# Altium schematic sheet 25_SATA-SATA PM0.SchDoc
size 594 x 420 mm
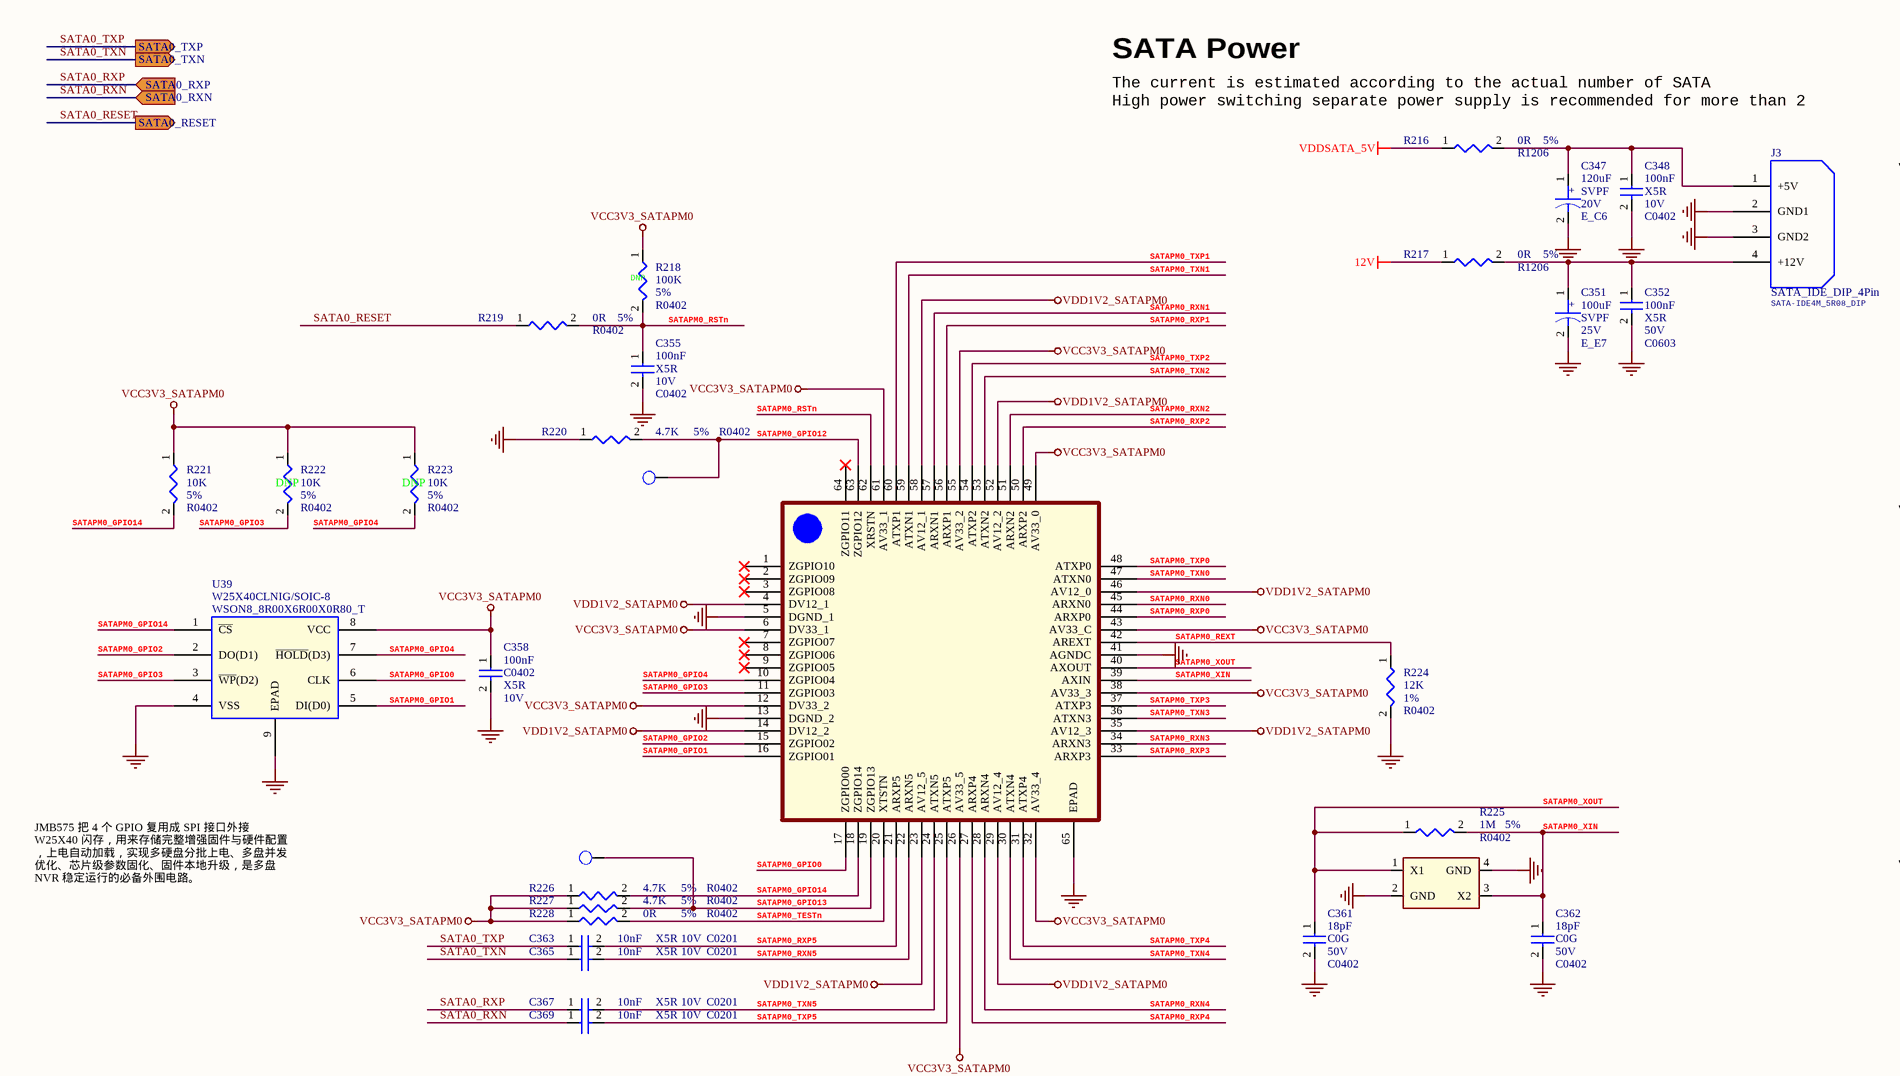
[diagram p0: 25_SATA-SATA PM0.SchDoc, top left]
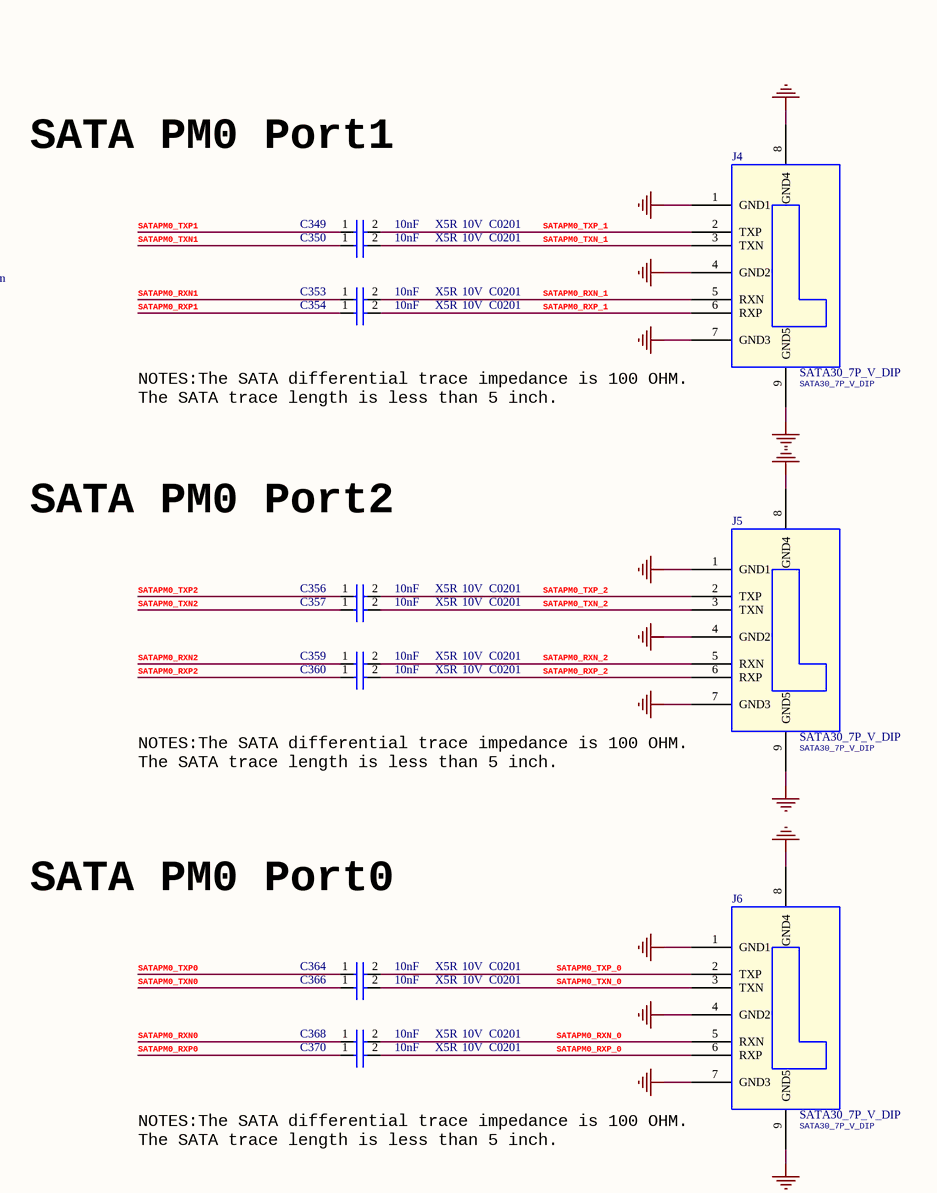
[diagram p1: 25_SATA-SATA PM0.SchDoc, top right]
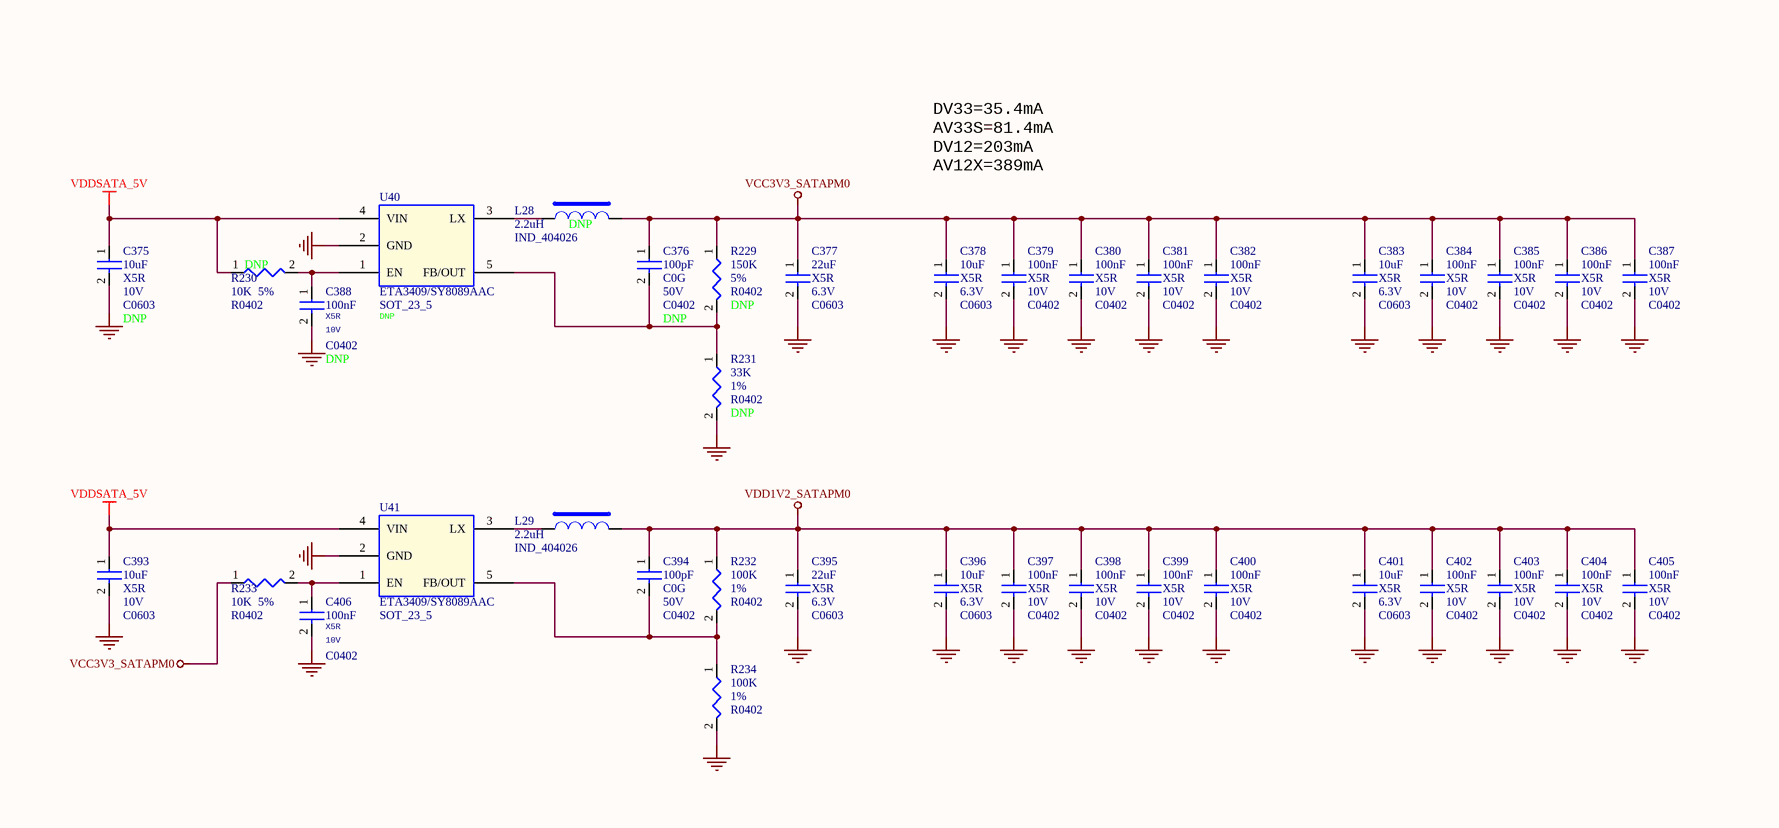
[diagram p2: 25_SATA-SATA PM0.SchDoc, bottom left]
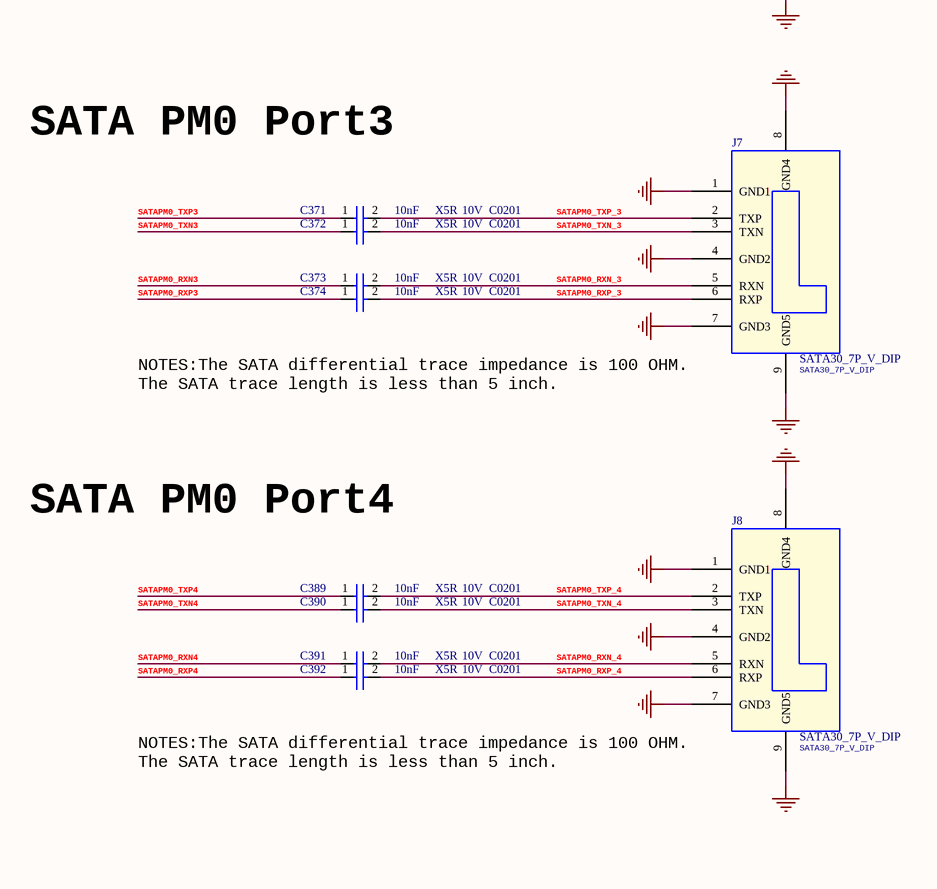
[diagram p3: 25_SATA-SATA PM0.SchDoc, bottom right]

## Parts
C347  120uF  Voltage: 20V  Dielectric: SVPF  [E_C6]
C348  100nF  Voltage: 10V  Dielectric: X5R  [C0402]
C349  10nF  Voltage: 10V  Dielectric: X5R  [C0201]
C350  10nF  Voltage: 10V  Dielectric: X5R  [C0201]
C351  100uF  Voltage: 25V  Dielectric: SVPF  [E_E7]
C352  100nF  Voltage: 50V  Dielectric: X5R  [C0603]
C353  10nF  Voltage: 10V  Dielectric: X5R  [C0201]
C354  10nF  Voltage: 10V  Dielectric: X5R  [C0201]
C355  100nF  Voltage: 10V  Dielectric: X5R  [C0402]
C356  10nF  Voltage: 10V  Dielectric: X5R  [C0201]
C357  10nF  Voltage: 10V  Dielectric: X5R  [C0201]
C358  100nF  Voltage: 10V  Dielectric: X5R  [C0402]
C359  10nF  Voltage: 10V  Dielectric: X5R  [C0201]
C360  10nF  Voltage: 10V  Dielectric: X5R  [C0201]
C361  18pF  Voltage: 50V  Dielectric: C0G  [C0402]
C362  18pF  Voltage: 50V  Dielectric: C0G  [C0402]
C363  10nF  Voltage: 10V  Dielectric: X5R  [C0201]
C364  10nF  Voltage: 10V  Dielectric: X5R  [C0201]
C365  10nF  Voltage: 10V  Dielectric: X5R  [C0201]
C366  10nF  Voltage: 10V  Dielectric: X5R  [C0201]
C367  10nF  Voltage: 10V  Dielectric: X5R  [C0201]
C368  10nF  Voltage: 10V  Dielectric: X5R  [C0201]
C369  10nF  Voltage: 10V  Dielectric: X5R  [C0201]
C370  10nF  Voltage: 10V  Dielectric: X5R  [C0201]
C371  10nF  Voltage: 10V  Dielectric: X5R  [C0201]
C372  10nF  Voltage: 10V  Dielectric: X5R  [C0201]
C373  10nF  Voltage: 10V  Dielectric: X5R  [C0201]
C374  10nF  Voltage: 10V  Dielectric: X5R  [C0201]
C375  10uF  Voltage: 10V  Dielectric: X5R  option: DNP  [C0603]
C376  100pF  Voltage: 50V  Dielectric: C0G  option: DNP  [C0402]
C377  22uF  Voltage: 6.3V  Dielectric: X5R  [C0603]
C378  10uF  Voltage: 6.3V  Dielectric: X5R  [C0603]
C379  100nF  Voltage: 10V  Dielectric: X5R  [C0402]
C380  100nF  Voltage: 10V  Dielectric: X5R  [C0402]
C381  100nF  Voltage: 10V  Dielectric: X5R  [C0402]
C382  100nF  Voltage: 10V  Dielectric: X5R  [C0402]
C383  10uF  Voltage: 6.3V  Dielectric: X5R  [C0603]
C384  100nF  Voltage: 10V  Dielectric: X5R  [C0402]
C385  100nF  Voltage: 10V  Dielectric: X5R  [C0402]
C386  100nF  Voltage: 10V  Dielectric: X5R  [C0402]
C387  100nF  Voltage: 10V  Dielectric: X5R  [C0402]
C388  100nF  Voltage: 10V  Dielectric: X5R  option: DNP  [C0402]
C389  10nF  Voltage: 10V  Dielectric: X5R  [C0201]
C390  10nF  Voltage: 10V  Dielectric: X5R  [C0201]
C391  10nF  Voltage: 10V  Dielectric: X5R  [C0201]
C392  10nF  Voltage: 10V  Dielectric: X5R  [C0201]
C393  10uF  Voltage: 10V  Dielectric: X5R  [C0603]
C394  100pF  Voltage: 50V  Dielectric: C0G  [C0402]
C395  22uF  Voltage: 6.3V  Dielectric: X5R  [C0603]
C396  10uF  Voltage: 6.3V  Dielectric: X5R  [C0603]
C397  100nF  Voltage: 10V  Dielectric: X5R  [C0402]
C398  100nF  Voltage: 10V  Dielectric: X5R  [C0402]
C399  100nF  Voltage: 10V  Dielectric: X5R  [C0402]
C400  100nF  Voltage: 10V  Dielectric: X5R  [C0402]
C401  10uF  Voltage: 6.3V  Dielectric: X5R  [C0603]
C402  100nF  Voltage: 10V  Dielectric: X5R  [C0402]
C403  100nF  Voltage: 10V  Dielectric: X5R  [C0402]
C404  100nF  Voltage: 10V  Dielectric: X5R  [C0402]
C405  100nF  Voltage: 10V  Dielectric: X5R  [C0402]
C406  100nF  Voltage: 10V  Dielectric: X5R  [C0402]
J3  SATA_IDE_DIP_4Pin  [SATA-IDE4M_5R08_DIP]
J4  SATA30_7P_V_DIP  [SATA30_7P_V_DIP]
J5  SATA30_7P_V_DIP  [SATA30_7P_V_DIP]
J6  SATA30_7P_V_DIP  [SATA30_7P_V_DIP]
J7  SATA30_7P_V_DIP  [SATA30_7P_V_DIP]
J8  SATA30_7P_V_DIP  [SATA30_7P_V_DIP]
L28  2.2uH  option: DNP  [IND_404026]
L29  2.2uH  [IND_404026]
R216  0R  PCB Footprint: R1206  Tolerance: 5%  [R0402]
R217  0R  PCB Footprint: R1206  Tolerance: 5%  [R0402]
R218  100K  Tolerance: 5%  Option: DNP  [R0402]
R219  0R  Tolerance: 5%  [R0402]
R220  4.7K  Tolerance: 5%  [R0402]
R221  10K  Tolerance: 5%  [R0402]
R222  10K  Tolerance: 5%  Option: DNP  [R0402]
R223  10K  Tolerance: 5%  Option: DNP  [R0402]
R224  12K  Tolerance: 1%  [R0402]
R225  1M  Tolerance: 5%  [R0402]
R226  4.7K  Tolerance: 5%  [R0402]
R227  4.7K  Tolerance: 5%  [R0402]
R228  0R  Tolerance: 5%  [R0402]
R229  150K  Tolerance: 5%  option: DNP  [R0402]
R230  10K  Tolerance: 5%  option: DNP  [R0402]
R231  33K  Tolerance: 1%  option: DNP  [R0402]
R232  100K  Tolerance: 1%  [R0402]
R233  10K  Tolerance: 5%  [R0402]
R234  100K  Tolerance: 1%  [R0402]
TP3  TP  [TP_0R70]  (value not drawn)
TP4  TP  [TP_0R70]  (value not drawn)
U38  JMB575  [QFN64_9R00X9R00X0R90_T]  (value not drawn)
U39  W25X40CLNIG/SOIC-8  [WSON8_8R00X6R00X0R80_T]
U40  ETA3409/SY8089AAC  option: DNP  [SOT_23_5]
U41  ETA3409/SY8089AAC  [SOT_23_5]
Y4  CRYSTAL_4P  [CRY4_3R20X2R50X0R80]  (value not drawn)

## Ports
SATA0_RESET (out), SATA0_RXN (in), SATA0_RXP (in), SATA0_TXN (out), SATA0_TXP (out)

## Nets
12V: R217.1
GND: C347.2 C348.2 C351.2 C352.2 C355.2 C358.2 C361.2 C362.2 C375.2 C377.2 C378.2 C379.2 C380.2 C381.2 C382.2 C383.2 C384.2 C385.2 C386.2 C387.2 C388.2 C393.2 C395.2 C396.2 C397.2 C398.2 C399.2 C400.2 C401.2 C402.2 C403.2 C404.2 C405.2 C406.2 J3.2(GND1) J3.3(GND2) J4.1(GND1) J4.4(GND2) J4.7(GND3) J4.8(GND4) J4.9(GND5) J5.1(GND1) J5.4(GND2) J5.7(GND3) J5.8(GND4) J5.9(GND5) J6.1(GND1) J6.4(GND2) J6.7(GND3) J6.8(GND4) J6.9(GND5) J7.1(GND1) J7.4(GND2) J7.7(GND3) J7.8(GND4) J7.9(GND5) J8.1(GND1) J8.4(GND2) J8.7(GND3) J8.8(GND4) J8.9(GND5) R220.1 R224.2 R231.2 R234.2 U38.5(DGND_1) U38.13(DGND_2) U38.41(AGNDC) U38.65(EPAD) U39.4(VSS) U39.9(EPAD) U40.2(GND) U41.2(GND) Y4.2(GND) Y4.4(GND)
VCC3V3_SATAPM0: C358.1 C376.1 C377.1 C378.1 C379.1 C380.1 C381.1 C382.1 C383.1 C384.1 C385.1 C386.1 C387.1 L28.2 R218.1 R221.1 R222.1 R223.1 R226.1 R227.1 R228.1 R229.1 R233.1 U38.6(DV33_1) U38.12(DV33_2) U38.26(AV33_5) U38.32(AV33_4) U38.38(AV33_3) U38.43(AV33_C) U38.49(AV33_0) U38.55(AV33_2) U38.61(AV33_1) U39.8(VCC)
VDD1V2_SATAPM0: C394.1 C395.1 C396.1 C397.1 C398.1 C399.1 C400.1 C401.1 C402.1 C403.1 C404.1 C405.1 L29.2 R232.1 U38.4(DV12_1) U38.14(DV12_2) U38.23(AV12_5) U38.29(AV12_4) U38.35(AV12_3) U38.46(AV12_0) U38.52(AV12_2) U38.58(AV12_1)
VDDSATA_5V: C375.1 C393.1 R216.1 R230.1 U40.4(VIN) U41.4(VIN)
SATA0_RESET: R219.1 ; port SATA0_RESET
SATA0_RXN: C369.1 ; port SATA0_RXN
SATA0_RXP: C367.1 ; port SATA0_RXP
SATA0_TXN: C365.1 ; port SATA0_TXN
SATA0_TXP: C363.1 ; port SATA0_TXP
SATAPM0_GPIO0: U38.17(ZGPIO00) U39.6(CLK)
SATAPM0_GPIO1: U38.16(ZGPIO01) U39.5(DI(D0))
SATAPM0_GPIO2: U38.15(ZGPIO02) U39.2(DO(D1))
SATAPM0_GPIO3: R222.2 U38.11(ZGPIO03) U39.3(~{WP}(D2))
SATAPM0_GPIO4: R223.2 U38.10(ZGPIO04) U39.7(~{HOLD}(D3))
SATAPM0_GPIO12: R220.2 TP3.1 U38.63(ZGPIO12)
SATAPM0_GPIO13: R227.2 TP4.1 U38.19(ZGPIO13)
SATAPM0_GPIO14: R221.2 R226.2 U38.18(ZGPIO14) U39.1(~{CS})
SATAPM0_REXT: R224.1 U38.42(AREXT)
SATAPM0_RSTn: C355.1 R218.2 R219.2 U38.62(XRSTN)
SATAPM0_RXN0: C368.1 U38.45(ARXN0)
SATAPM0_RXN1: C353.1 U38.57(ARXN1)
SATAPM0_RXN2: C359.1 U38.51(ARXN2)
SATAPM0_RXN3: C373.1 U38.34(ARXN3)
SATAPM0_RXN4: C391.1 U38.28(ARXN4)
SATAPM0_RXN5: C365.2 U38.22(ARXN5)
SATAPM0_RXN_0: C368.2 J6.5(RXN)
SATAPM0_RXN_1: C353.2 J4.5(RXN)
SATAPM0_RXN_2: C359.2 J5.5(RXN)
SATAPM0_RXN_3: C373.2 J7.5(RXN)
SATAPM0_RXN_4: C391.2 J8.5(RXN)
SATAPM0_RXP0: C370.1 U38.44(ARXP0)
SATAPM0_RXP1: C354.1 U38.56(ARXP1)
SATAPM0_RXP2: C360.1 U38.50(ARXP2)
SATAPM0_RXP3: C374.1 U38.33(ARXP3)
SATAPM0_RXP4: C392.1 U38.27(ARXP4)
SATAPM0_RXP5: C363.2 U38.21(ARXP5)
SATAPM0_RXP_0: C370.2 J6.6(RXP)
SATAPM0_RXP_1: C354.2 J4.6(RXP)
SATAPM0_RXP_2: C360.2 J5.6(RXP)
SATAPM0_RXP_3: C374.2 J7.6(RXP)
SATAPM0_RXP_4: C392.2 J8.6(RXP)
SATAPM0_TESTn: R228.2 U38.20(XTSTN)
SATAPM0_TXN0: C366.1 U38.47(ATXN0)
SATAPM0_TXN1: C350.1 U38.59(ATXN1)
SATAPM0_TXN2: C357.1 U38.53(ATXN2)
SATAPM0_TXN3: C372.1 U38.36(ATXN3)
SATAPM0_TXN4: C390.1 U38.30(ATXN4)
SATAPM0_TXN5: C367.2 U38.24(ATXN5)
SATAPM0_TXN_0: C366.2 J6.3(TXN)
SATAPM0_TXN_1: C350.2 J4.3(TXN)
SATAPM0_TXN_2: C357.2 J5.3(TXN)
SATAPM0_TXN_3: C372.2 J7.3(TXN)
SATAPM0_TXN_4: C390.2 J8.3(TXN)
SATAPM0_TXP0: C364.1 U38.48(ATXP0)
SATAPM0_TXP1: C349.1 U38.60(ATXP1)
SATAPM0_TXP2: C356.1 U38.54(ATXP2)
SATAPM0_TXP3: C371.1 U38.37(ATXP3)
SATAPM0_TXP4: C389.1 U38.31(ATXP4)
SATAPM0_TXP5: C369.2 U38.25(ATXP5)
SATAPM0_TXP_0: C364.2 J6.2(TXP)
SATAPM0_TXP_1: C349.2 J4.2(TXP)
SATAPM0_TXP_2: C356.2 J5.2(TXP)
SATAPM0_TXP_3: C371.2 J7.2(TXP)
SATAPM0_TXP_4: C389.2 J8.2(TXP)
SATAPM0_XIN: C362.1 R225.2 U38.39(AXIN) Y4.3(X2)
SATAPM0_XOUT: C361.1 R225.1 U38.40(AXOUT) Y4.1(X1)
NetC347_1: C347.1 C348.1 J3.1(+5V) R216.2
NetC351_1: C351.1 C352.1 J3.4(+12V) R217.2
NetC376_2: C376.2 R229.2 R231.1 U40.5(FB/OUT)
NetC388_1: C388.1 R230.2 U40.1(EN)
NetC394_2: C394.2 R232.2 R234.1 U41.5(FB/OUT)
NetC406_1: C406.1 R233.2 U41.1(EN)
NetL28_1: L28.1 U40.3(LX)
NetL29_1: L29.1 U41.3(LX)

Not connected (* = marked no-connect by the designer): U38 1(ZGPIO10)* 2(ZGPIO09)* 3(ZGPIO08)* 7(ZGPIO07)* 8(ZGPIO06)* 9(ZGPIO05)* 64(ZGPIO11)*

## Notes on the sheet
- SATA Power
- (near R216) The current is estimated according to the actual number of SATA
  High power switching separate power supply is recommended for more than 2
- SATA PM0 Port1
- (near J4) NOTES:The SATA differential trace impedance is 100 OHM.
  The SATA trace length is less than 5 inch.
- SATA PM0 Port2
- (near J5) NOTES:The SATA differential trace impedance is 100 OHM.
  The SATA trace length is less than 5 inch.
- SATA PM0 Port0
- JMB575 把 4 个 GPIO 复用成 SPI 接口外接 W25X40 闪存，用来存储完整增强固件与硬件配置，上电自动加载，实现多硬盘分批上电、多盘并发优化、芯片级参数固化、固件本地升级，是多盘 NVR 稳定运行的必备外围电路。
- (near J6) NOTES:The SATA differential trace impedance is 100 OHM.
  The SATA trace length is less than 5 inch.
- SATA PM0 Port3
- DV33=35.4mA
  AV33S=81.4mA
  DV12=203mA
  AV12X=389mA
- (near J7) NOTES:The SATA differential trace impedance is 100 OHM.
  The SATA trace length is less than 5 inch.
- SATA PM0 Port4
- (near J8) NOTES:The SATA differential trace impedance is 100 OHM.
  The SATA trace length is less than 5 inch.
- (in symbol CAP) +

## Library data of the parts
C347 = CAP: 120uF,20V,25mR,SVPF; Manufacturer PN: 25SVPF100M; Manufacturer: Panasonic; Tolerance: 20%; Priority: A; PCB Footprint: E_C6; Created by: JJJ; Part Type: 贴片固态铝电解; RK PN: 25SVPF100M
C348 = CAP NP: cap,100.00nF,+/-10%,10V,X5R,C0402; Manufacturer: TDK; Number: 37; RK PN: C1005X5R1A104K050BA; Priority: A; Tolerance: 10%; C_Voltage: 6.3V; PCB Footprint: C0402; Part Type: C0402; Manufacturer PN: C1005X5R1A104K050BA; Created by: JJJ
C349 C350 C353 C354 C356 C357 C359 C360 C364 C366 C368 C370-C374 C389-C392 = CAP NP: cap,10.00nF,+/-10%,10V,X5R,C0201; Manufacturer PN: C0603X5R1A103K030BA; Manufacturer: TDK; Tolerance: 10%; Priority: A; PCB Footprint: C0201; Created by: JJJ; Part Type: C0201; RK PN: C0603X5R1A103K030BA
C351 = CAP: 100uF,25V,24mR,SVPF; Manufacturer PN: 25SVPF100M; Manufacturer: Panasonic; Tolerance: 20%; Priority: A; PCB Footprint: E_E7; Created by: JJJ; Part Type: 贴片固态铝电解; RK PN: 25SVPF100M
C352 = CAP NP: cap,100.00nF,+/-10%,50V,X5R,C0603; Manufacturer PN: C1608X5R1H104K080AA; Manufacturer: TDK; Tolerance: 10%; Priority: A; PCB Footprint: C0603; Created by: JJJ; Part Type: C0603; RK PN: C1608X5R1H104K080AA
C355 C358 = CAP NP: cap,100.00nF,+/-10%,10V,X5R,C0402; Manufacturer: TDK; RK PN: C1005X5R1A104K050BA; Priority: A; Tolerance: 10%; PCB Footprint: C0402; Part Type: C0402; Manufacturer PN: C1005X5R1A104K050BA; Created by: JJJ
C361 C362 = CAP NP: cap,18.00pF,+/-5%,50V,C0G,C0402; Manufacturer: TDK; RK PN: C1005C0G1H180J050BA; Priority: A; Tolerance: 5%; PCB Footprint: C0402; Part Type: C0402; Manufacturer PN: C1005C0G1H180J050BA; Created by: JJJ
C363 C365 C367 C369 = CAP NP: cap,10.00nF,+/-10%,10V,X5R,C0201; Manufacturer: TDK; RK PN: C0603X5R1A103K030BA; Priority: A; Tolerance: 10%; PCB Footprint: C0201; Part Type: C0201; Manufacturer PN: C0603X5R1A103K030BA; Created by: JJJ
C375 = CAP NP: cap,10.00uF,+/-10%,10V,X5R,C0603; Manufacturer PN: C1608X5R1A106K080AC; Manufacturer: TDK; Tolerance: 10%; Priority: A; PCB Footprint: C0603; Created by: JJJ; Part Type: C0603; RK PN: C1608X5R1A106K080AC
C376 = CAP NP: cap,100.00pF,+/-10%,50V,C0G,C0402; Manufacturer: TDK; RK PN: C1005C0G1H101K050BA; Priority: A; Tolerance: 10%; PCB Footprint: C0402; Part Type: C0402; Manufacturer PN: C1005C0G1H101K050BA; Created by: JJJ
C377 = CAP NP: cap,22.00uF,+/-20%,6.3V,X5R,C0603; Manufacturer PN: C1608X5R0J226M080AC; Manufacturer: TDK; Tolerance: 20%; Priority: A; PCB Footprint: C0603; Created by: JJJ; C_Voltage: 6.3V; Part Type: C0603; RK PN: C1608X5R0J226M080AC
C378 C383 C396 C401 = CAP NP: cap,10.00uF,+/-10%,6.3V,X5R,C0603; Manufacturer: TDK; RK PN: C1608X5R0J106K080AB; Priority: A; Tolerance: 10%; PCB Footprint: C0603; Part Type: C0603; C_Voltage: 6.3V; Manufacturer PN: C1608X5R0J106K080AB; Created by: JJJ
C379-C382 C384-C387 C397-C400 C402-C405 = CAP NP: cap,100.00nF,+/-10%,10V,X5R,C0402; Manufacturer PN: C1005X5R1A104K050BA; Manufacturer: TDK; C_Voltage: 6.3V; Tolerance: 10%; Priority: A; Number: 37; PCB Footprint: C0402; Created by: JJJ; Part Type: C0402; RK PN: C1005X5R1A104K050BA
C388 = CAP NP: cap,100.00nF,+/-10%,10V,X5R,C0402; Manufacturer PN: C1005X5R1A104K050BA; Manufacturer: TDK; Priority: A; Tolerance: 10%; PCB Footprint: C0402; Created by: JJJ; Part Type: C0402; RK PN: C1005X5R1A104K050BA
C393 = CAP NP: cap,10.00uF,+/-10%,10V,X5R,C0603; Manufacturer: TDK; RK PN: C1608X5R1A106K080AC; Priority: A; Tolerance: 10%; PCB Footprint: C0603; Part Type: C0603; Manufacturer PN: C1608X5R1A106K080AC; Created by: JJJ
C394 = CAP NP: cap,100.00pF,+/-10%,50V,C0G,C0402; Manufacturer PN: C1005C0G1H101K050BA; Manufacturer: TDK; Tolerance: 10%; Priority: A; PCB Footprint: C0402; Created by: JJJ; Part Type: C0402; RK PN: C1005C0G1H101K050BA
C395 = CAP NP: cap,22.00uF,+/-20%,6.3V,X5R,C0603; Manufacturer: TDK; RK PN: C1608X5R0J226M080AC; Priority: A; Tolerance: 20%; PCB Footprint: C0603; Part Type: C0603; C_Voltage: 6.3V; Manufacturer PN: C1608X5R0J226M080AC; Created by: JJJ
C406 = CAP NP: cap,100.00nF,+/-10%,10V,X5R,C0402; Manufacturer: TDK; Tolerance: 10%; RK PN: C1005X5R1A104K050BA; Priority: A; PCB Footprint: C0402; Part Type: C0402; Manufacturer PN: C1005X5R1A104K050BA; Created by: JJJ
J3 = SATA_IDE_DIP_0: PCB Footprint: SATA-IDE4M_5R08_DIP
J4-J8 = SATA_DIP_0: PCB Footprint: SATA30_7P_V_DIP
L28 = INDUCTORS OF FERRITE_Dup1: Power Inductor,2.2uH,0.2,IND_404026; Manufacturer: sunlord; Isat: 2.10A; DC Resistor: 0.04ohm; RK PN: SWPA4026S2R2MT; Priority: A; Tolerance: 20%; Irms: 2A; Resonace frequency: 96M; PCB Footprint: IND_404026; Part Type: POWER_IND; Manufacturer PN: SWPA4026S2R2MT; Created by: YTL
L29 = INDUCTORS OF FERRITE_Dup1: Power Inductor,2.2uH,0.2,IND_404026; Manufacturer PN: SWPA4026S2R2MT; Manufacturer: sunlord; Isat: 2.10A; DC Resistor: 0.04ohm; Resonace frequency: 96M; Irms: 2A; Tolerance: 20%; Priority: A; PCB Footprint: IND_404026; Created by: YTL; Part Type: POWER_IND; RK PN: SWPA4026S2R2MT
R216 R217 = RESISTOR_Dup1: 通用厚膜电阻,0R,+/-5%,R1206,1/4W.; Manufacturer: YAGEO; RK PN: RC1206JR-070RL; Priority: A; Wattage: 1/4W; Part Type: 通用厚膜电阻; Manufacturer PN: RC1206JR-070RL; Created by: YTL
R218 = RESISTOR_Dup1: 通用厚膜电阻,100K,+/-5%,R0402,1/16W.; Manufacturer PN: RC0402JR-07100KL; Manufacturer: YAGEO; Wattage: 1/16W; Priority: A; PCB Footprint: R0402; Created by: YTL; Part Type: 通用厚膜电阻; RK PN: RC0402JR-07100KL
R219 R228 = RESISTOR_Dup1: 通用厚膜电阻,0R,+/-5%,R0402,1/16W.; Manufacturer: YAGEO; RK PN: RC0402JR-070RL; Priority: A; Wattage: 1/16W; PCB Footprint: R0402; Part Type: 通用厚膜电阻; Manufacturer PN: RC0402JR-070RL; Created by: YTL
R220 R226 = RESISTOR_Dup1: 通用厚膜电阻,4K7,+/-5%,R0402,1/16W.; Manufacturer: YAGEO; RK PN: RC0402JR-074K7L; Priority: A; Wattage: 1/16W; PCB Footprint: R0402; Part Type: 通用厚膜电阻; Manufacturer PN: RC0402JR-074K7L; Created by: YTL
R221 R223 R230 = RESISTOR_Dup1: 通用厚膜电阻,10K,+/-5%,R0402,1/16W.; Manufacturer PN: RC0402JR-0710KL; Manufacturer: YAGEO; Wattage: 1/16W; Priority: A; PCB Footprint: R0402; Created by: YTL; Part Type: 通用厚膜电阻; RK PN: RC0402JR-0710KL
R222 R233 = RESISTOR_Dup1: 通用厚膜电阻,10K,+/-5%,R0402,1/16W.; Manufacturer: YAGEO; RK PN: RC0402JR-0710KL; Priority: A; Wattage: 1/16W; PCB Footprint: R0402; Part Type: 通用厚膜电阻; Manufacturer PN: RC0402JR-0710KL; Created by: YTL
R224 = RESISTOR_Dup1: 通用厚膜电阻,12K,+/-1%,R0402,1/16W.; Manufacturer PN: RC0402FR-0712KL; Manufacturer: YAGEO; Wattage: 1/16W; Priority: A; PCB Footprint: R0402; Created by: YTL; Part Type: 通用厚膜电阻; RK PN: RC0402FR-0712KL
R225 = RESISTOR_Dup1: 通用厚膜电阻,1M,+/-5%,R0402,1/16W.; Manufacturer: YAGEO; RK PN: RC0402JR-071ML; Priority: A; Wattage: 1/16W; PCB Footprint: R0402; Part Type: 通用厚膜电阻; Manufacturer PN: RC0402JR-071ML; Created by: YTL
R227 = RESISTOR_Dup1: 通用厚膜电阻,4K7,+/-5%,R0402,1/16W.; Manufacturer PN: RC0402JR-074K7L; Manufacturer: YAGEO; Wattage: 1/16W; Priority: A; PCB Footprint: R0402; Created by: YTL; Part Type: 通用厚膜电阻; RK PN: RC0402JR-074K7L
R229 = RESISTOR_Dup1: 通用厚膜电阻,150K,+/-5%,R0402,1/16W.; Manufacturer PN: RC0402JR-07150KL; Manufacturer: YAGEO; Wattage: 1/16W; Priority: A; PCB Footprint: R0402; Created by: YTL; Part Type: 通用厚膜电阻; RK PN: RC0402JR-07150KL
R231 = RESISTOR_Dup1: 通用厚膜电阻,33K,+/-1%,R0402,1/16W.; Manufacturer: YAGEO; RK PN: RC0402FR-0733KL; Priority: A; Wattage: 1/16W; PCB Footprint: R0402; Part Type: 通用厚膜电阻; Manufacturer PN: RC0402FR-0733KL; Created by: YTL
R232 R234 = RESISTOR_Dup1: 通用厚膜电阻,100K,+/-1%,R0402,1/16W.; Manufacturer PN: RC0402FR-07100KL; Manufacturer: YAGEO; Wattage: 1/16W; Priority: A; PCB Footprint: R0402; Created by: YTL; Part Type: 通用厚膜电阻; RK PN: RC0402FR-07100KL
U39 = SPI_FLASH_8PIN_T_0: 256M-bit Serial Flash;32M-byte;3.3V Uniform Sector;Dual and Quad Serial Flash;; Manufacturer: GigaDevice; RK PN: GD25Q256CYGR; Priority: A; PCB Footprint: WSON8_8R00X6R00X0R80_T; Part Type: SPI_FLASH; Manufacturer PN: GD25Q256CYGR; Created by: JJJ
U40 U41 = DCDC_SY8088: High Efficiency 5.5V, 2A continuous, 3A peak, 1MHz Synchronous Step Down Regulator; Manufacturer: Silergy（矽力杰）; Priority: A; PCB Footprint: SOT_23_5; RK PN: SY8089AAC; Part Type: DCDC; Manufacturer PN: SY8089AAC; Created by: JJJ